# EAGLE design Shield pololu (EAGLE 9.2.0)
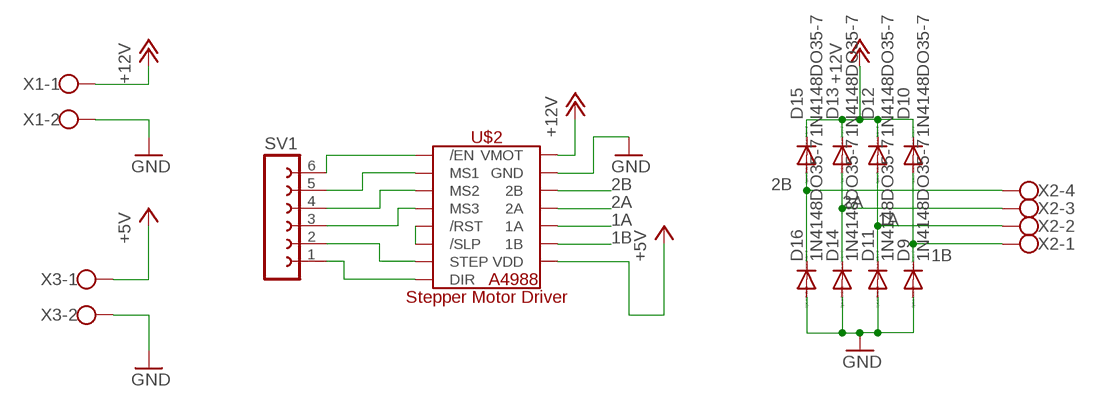
[diagram p0: schematic, sheet 1]

## Parts
D9  1N4148DO35-7  [DO35-7]
D10  1N4148DO35-7  [DO35-7]
D11  1N4148DO35-7  [DO35-7]
D12  1N4148DO35-7  [DO35-7]
D13  1N4148DO35-7  [DO35-7]
D14  1N4148DO35-7  [DO35-7]
D15  1N4148DO35-7  [DO35-7]
D16  1N4148DO35-7  [DO35-7]
SV1  FE06-1  [FE06]
U$2  A4988_STEP  [A4988_STEP]
X1  W237-102  [W237-102]
X2  W237-4  [W237-4]
X3  W237-102  [W237-102]

## Nets
1A: D11.C D12.A U$2.1A X2.2
1B: D9.C D10.A U$2.1B X2.1
2A: D13.A D14.C U$2.2A X2.3
2B: D15.A D16.C U$2.2B X2.4
+5V: U$2.VDD X3.1
+12V: D10.C D12.C D13.C D15.C U$2.VMOT X1.1
GND: D9.A D11.A D14.A D16.A U$2.GND U$2.GND2(GND) X1.2 X3.2
N$1: SV1.6 U$2./EN
N$2: SV1.5 U$2.MS1
N$3: SV1.4 U$2.MS2
N$4: SV1.3 U$2.MS3
N$5: SV1.2 U$2.STEP
N$6: SV1.1 U$2.DIR
N$10: U$2./RST U$2./SLP

## Library data of the parts
D9-D16 = diode:1N4148: DIODE high speed (Philips)
SV1 = con-lsta:FE06-1: FEMALE HEADER; OC_FARNELL: unknown; OC_NEWARK: unknown
U$2 = IC:A4988_STEP
X1 X3 = con-wago-500:W237-102: WAGO SCREW CLAMP; MPN: 237-102; OC_FARNELL: unknown; OC_NEWARK: 70K9898
X2 = con-wago-500:W237-4: WAGO SCREW CLAMP; OC_FARNELL: unknown; OC_NEWARK: unknown

## Board
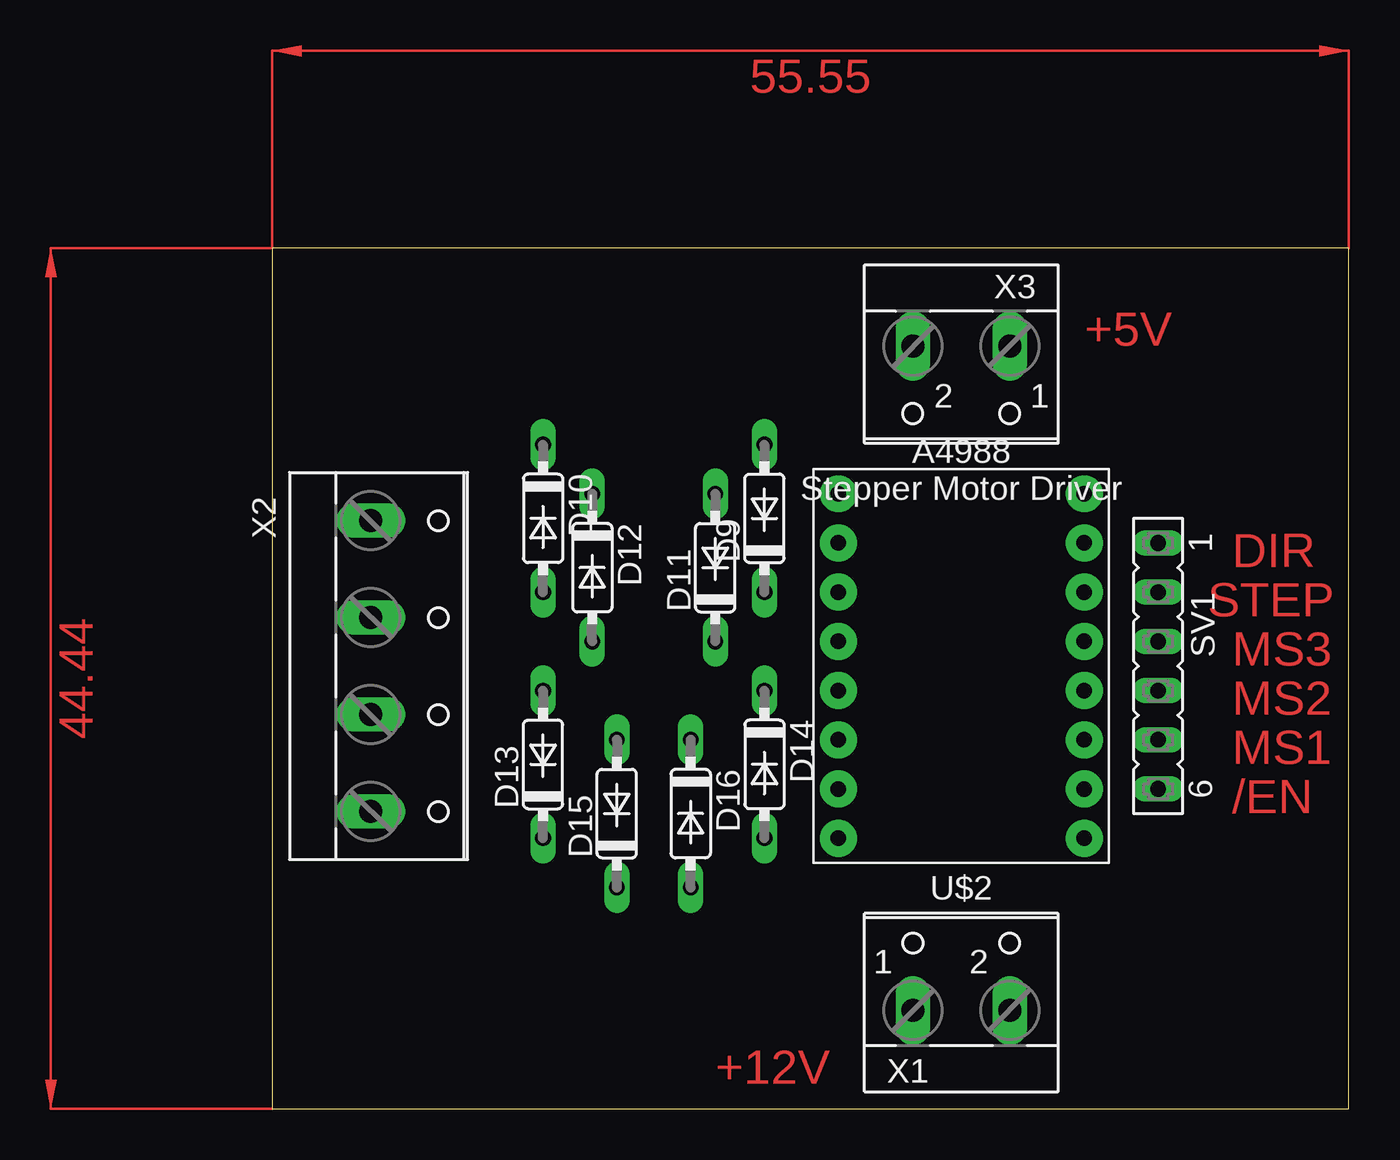
[diagram p1: board, top side]
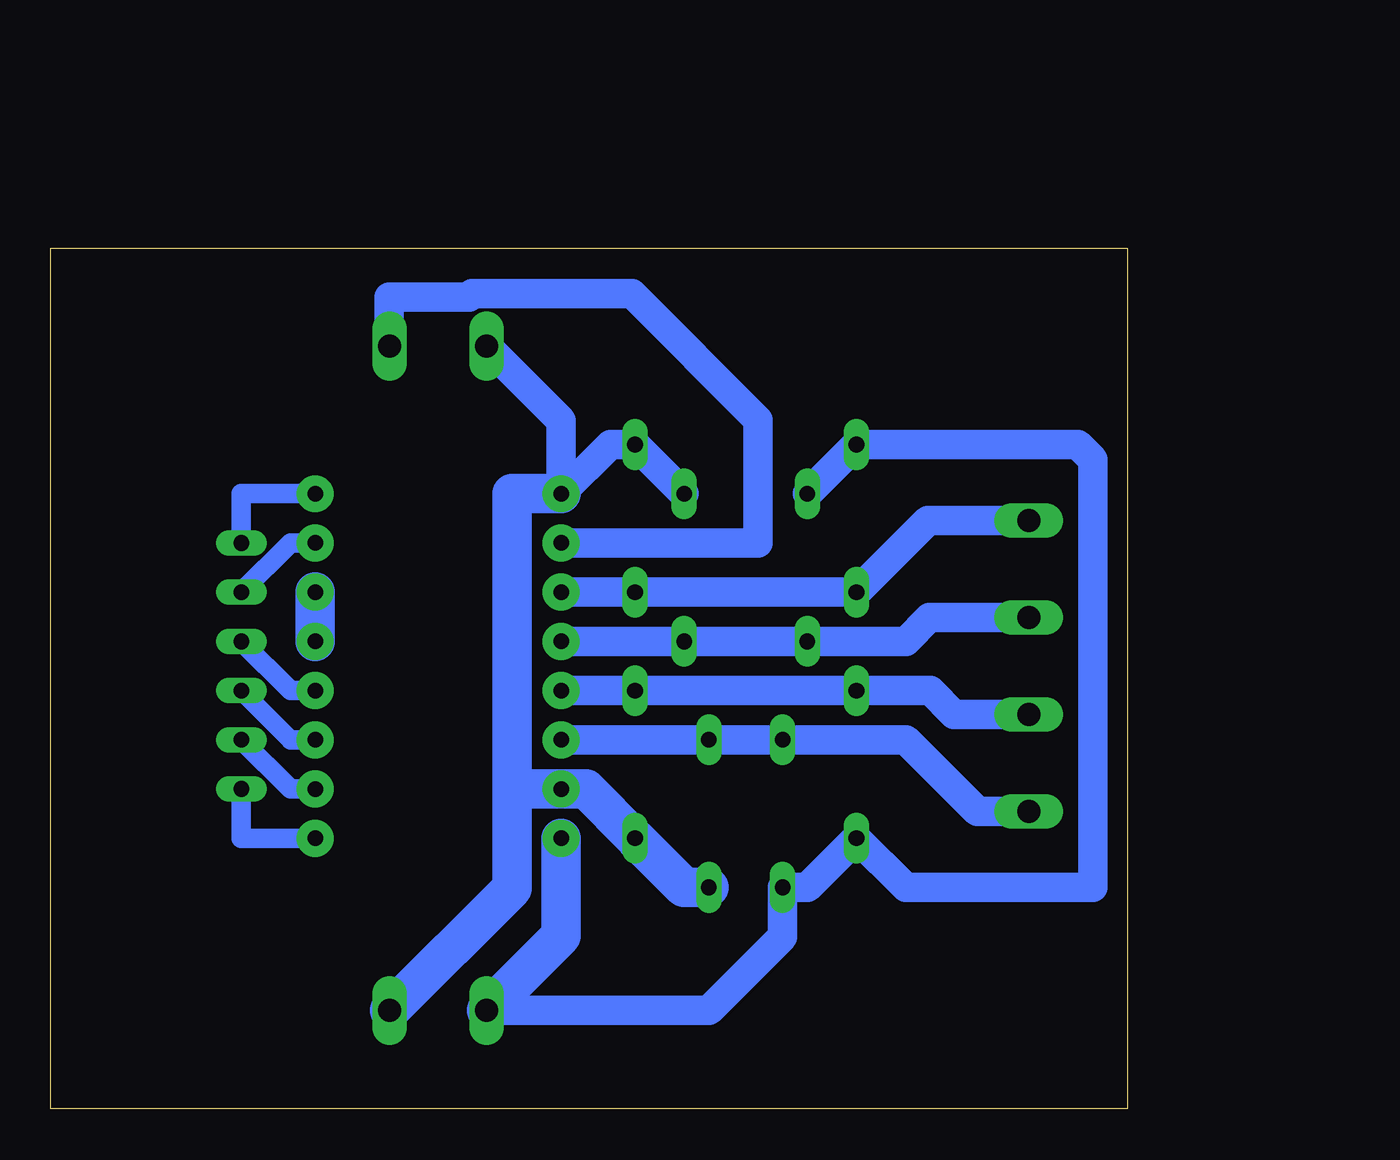
[diagram p2: board, bottom side, seen from below]

Size 55.55 x 44.44 mm. Coordinates in mm from the lower left corner, seen from the top.
Outline: 0,0 55.55,0 55.55,44.44 0,44.44 0,0
Copper layers (1*16): Top 0.035mm / dielectric 1.5mm / Bottom 0.035mm
Design rules "default": minimum track width 6mil, minimum drill 0.35mm, track to track 6mil, track to pad 6mil, pad to pad 6mil, via to via 6mil, smd to smd 6mil, copper to edge 40mil, drill to drill 6mil, minimum pad ring 10mil, minimum via ring 8mil, stop-mask expansion 4mil, vias tented up to drill 0mil, thermal gap 10mil

### Footprints (pad centres in the part's own frame; a part is rotated, then mirrored left to right if it is on the bottom)
DO35-7 = drill 0.813 long: A 3.81,0; C -3.81,0
FE06 = drill 0.813 long: 1 -6.35,0; 2 -3.81,0; 3 -1.27,0; 4 1.27,0; 5 3.81,0; 6 6.35,0
A4988_STEP = drill 0.8 pad 1.905: 1A 6.35,-1.27; 1B 6.35,-3.81; 2A 6.35,1.27; 2B 6.35,3.81; /EN -6.35,8.89; /RST -6.35,-1.27; /SLP -6.35,-3.81; DIR -6.35,-8.89; GND 6.35,6.35; GND2 6.35,-8.89; MS1 -6.35,6.35; MS2 -6.35,3.81; MS3 -6.35,1.27; STEP -6.35,-6.35; VDD 6.35,-6.35; VMOT 6.35,8.89
W237-102 = drill 1.194 long: 1 -2.5,-1.27; 2 2.5,-1.27
W237-4 = drill 1.194 long: 1 -7.5,-1.27; 2 -2.5,-1.27; 3 2.5,-1.27; 4 7.5,-1.27

### Placement (x,y rotation side)
D9  25.4,30.48 90 top
D10  13.97,30.48 270 top
D11  22.86,27.94 90 top
D12  16.51,27.94 270 top
D13  13.97,17.78 90 top
D14  25.4,17.78 270 top
D15  17.78,15.24 90 top
D16  21.59,15.24 270 top
SV1  45.72,22.86 270 top
U$2  35.56,22.86 180 top
X1  35.56,6.35 0 top
X2  6.35,22.86 270 top
X3  35.56,38.1 180 top

### Tracks (layer width: path | path; a pad name or v marks a point on that pad's centre or on a via)
1A
  Bottom 1.524: X2.2 10.2,25.36 11.43,24.13 D12.A D11.C U$2.1A
1B
  Bottom 1.524: U$2.1B D9.C D10.A 10.28,30.36 X2.1
2A
  Bottom 0.152: 8.93,20.36 8.89,20.36
  Bottom 1.524: 8.89,20.36 X2.3 | 8.93,20.36 10.16,21.59 D13.A D14.C U$2.2A
2B
  Bottom 1.524: X2.4 7.74,15.36 11.43,19.05 D15.A D16.C U$2.2B
+5V
  Bottom 1.524: U$2.VDD 19.05,29.21 19.05,35.56 25.57,42.08 33.81,42.08 33.98,41.91 38.1,41.91 38.1,39.41 X3.1
+12V
  Bottom 0.152: X1.1 33.02,5.08
  Bottom 1.524: 33.02,5.08 21.59,5.08 17.78,8.89 D15.C 16.51,11.43 D13.C 11.43,11.43 1.78,11.43 1.78,33.53 2.54,34.29 D10.C D12.C
  Bottom 2.032: X1.1 29.21,8.93 U$2.VMOT
GND
  Bottom 0.152: X3.2 33.04,39.35
  Bottom 1.524: D11.A D9.A 26.67,34.29 U$2.GND2 29.21,35.52 33.04,39.35
  Bottom 2.032: D16.A 22.86,11.43 D14.A 27.94,16.51 U$2.GND 31.75,16.51 | X1.2 31.75,11.39 31.75,16.51 | U$2.GND2 31.75,31.75 31.75,16.51
N$1
  Bottom 1.016: U$2./EN 45.72,13.97 SV1.6
N$2
  Bottom 1.016: U$2.MS1 43.18,16.51 SV1.5
N$3
  Bottom 1.016: U$2.MS2 43.18,19.05 SV1.4
N$4
  Bottom 1.016: U$2.MS3 43.18,21.59 SV1.3
N$5
  Bottom 1.016: U$2.STEP 43.18,29.21 SV1.2
N$6
  Bottom 1.016: U$2.DIR 45.72,31.75 SV1.1
N$10
  Bottom 2.032: U$2./SLP U$2./RST
(copper drawn outside any net)
  shapes: Top area x2

### Text on the board
Top: +5V | DIR | STEP | MS3 | MS2 | MS1 | /EN | +12V